# EAGLE design EVGP Daugherboard (EAGLE 9.5.0)
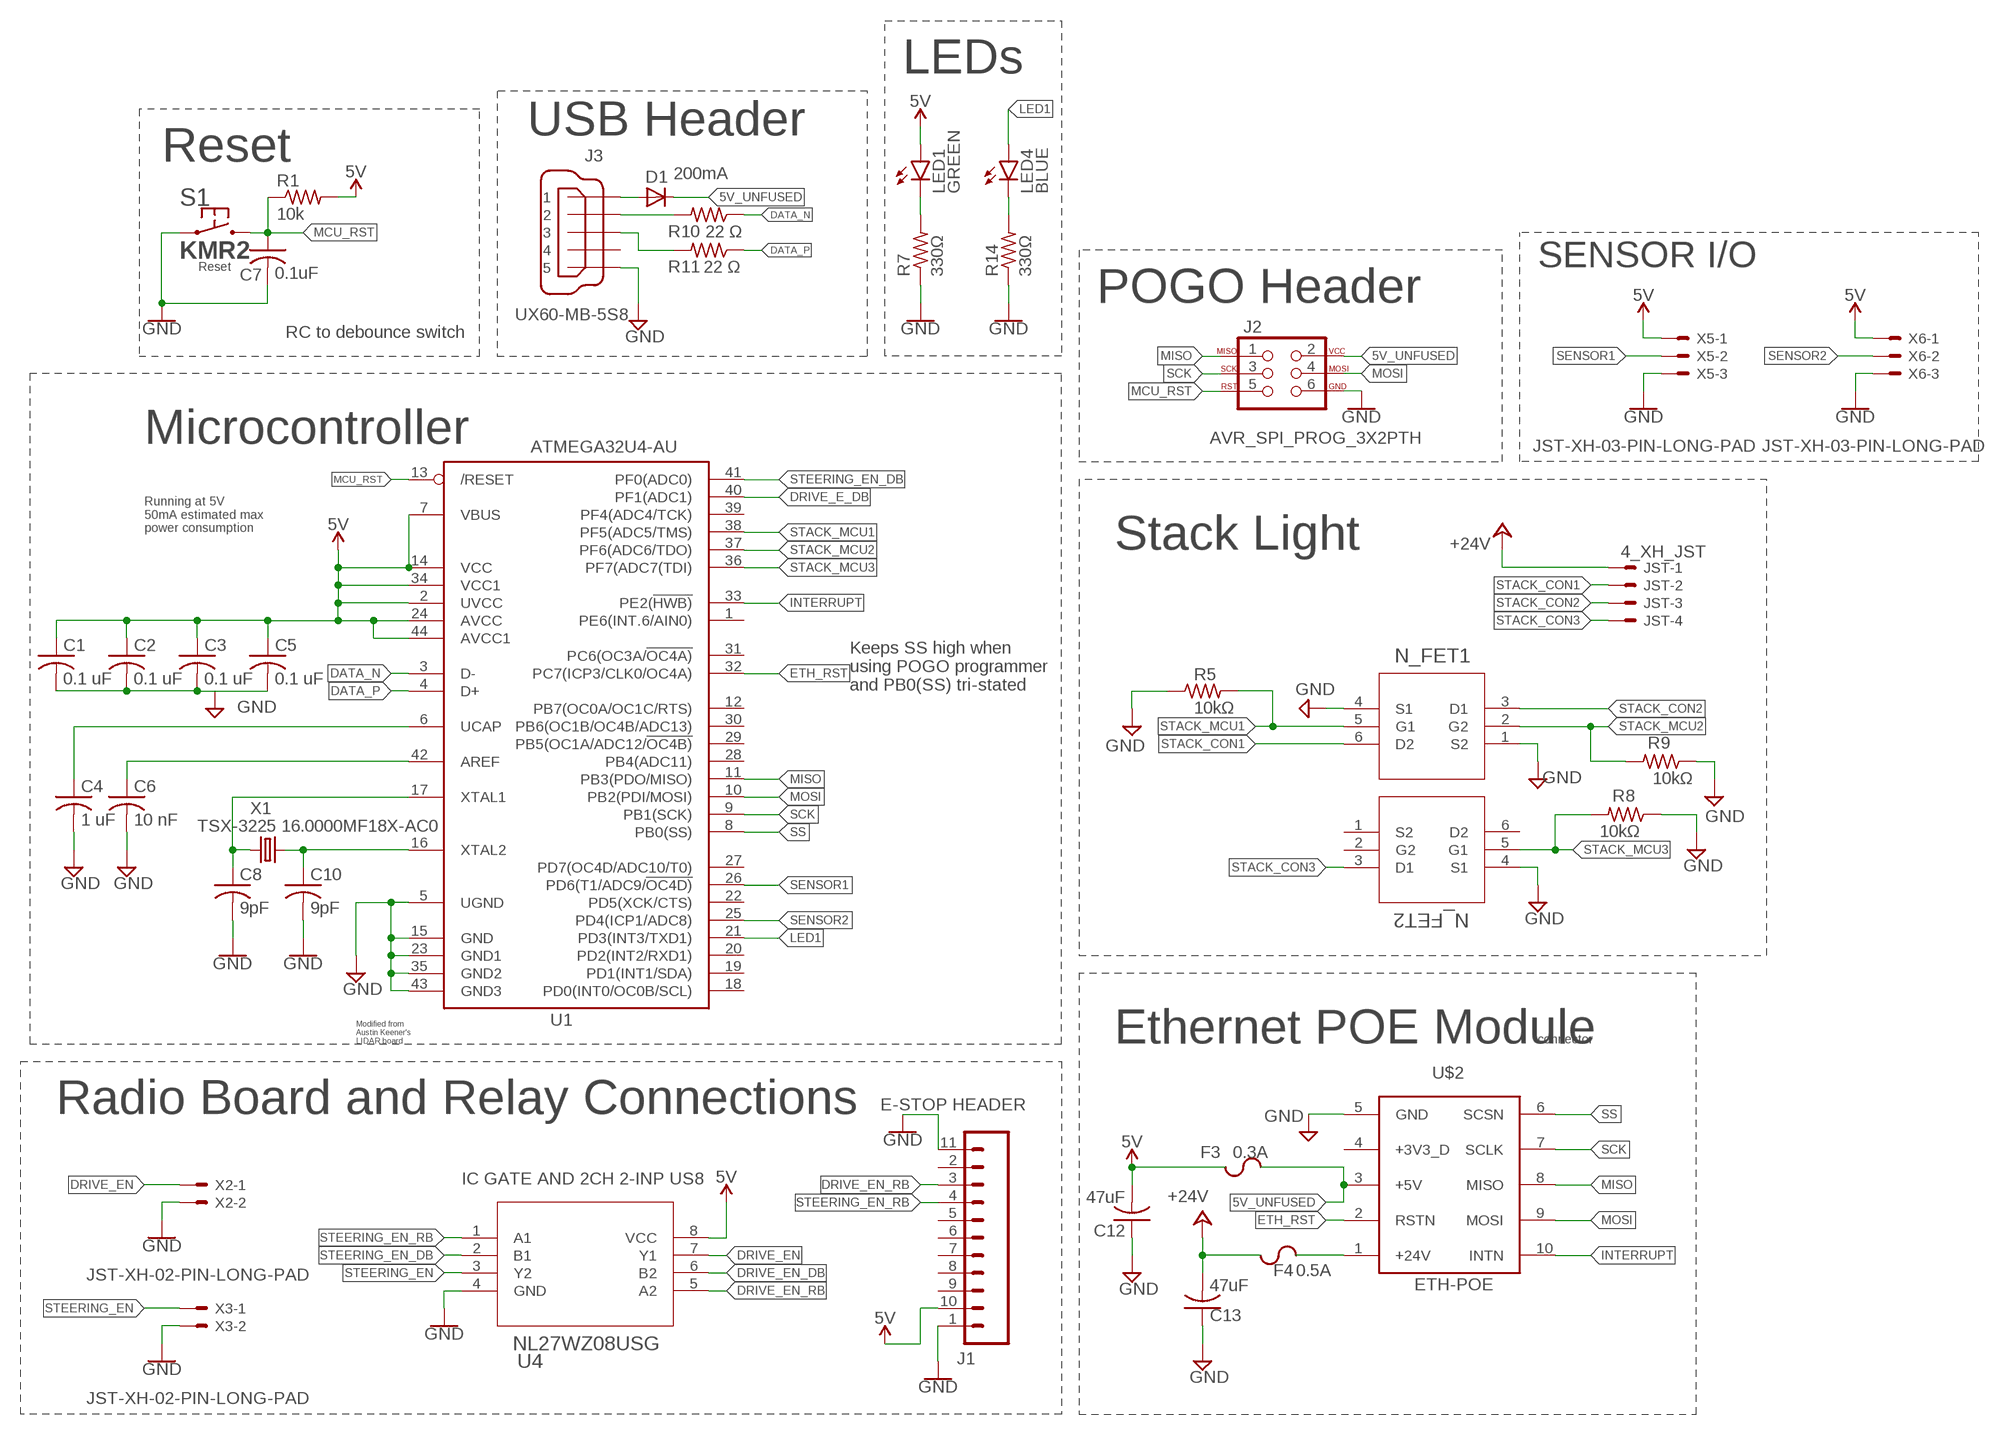
[diagram p0: schematic, sheet 1]

## Parts
C1  0.1 uF  C-USC0603  [C0603]
C2  0.1 uF  C-USC0603  [C0603]
C3  0.1 uF  C-USC0603  [C0603]
C4  1 uF  C-USC0603  [C0603]
C5  0.1 uF  C-USC0603  [C0603]
C6  10 nF  C-USC0603  [C0603]
C7  0.1uF  C-USC0603  [C0603]
C8  9pF  C-USC0603  [C0603]
C10  9pF  C-USC0603  [C0603]
C12  47uF  C-USC1206  [C1206]
C13  47uF  C-USC1206  [C1206]
D1  200mA  DIODE-SOD323-R  [SOD323-R]
F3  0.3A  CHIP_FUSE1206  [F1206]
F4  0.5A  CHIP_FUSE1206  [F1206]
J1  E-STOP HEADER  ESTOP_RADIO  [RADIO_V1.3]
J2  AVR_SPI_PROG_3X2PTH  [2X3]
J3  UX60-MB-5S8  [UX60-MB-5S8]
JST  4_XH_JST  JST-XH-04-PIN-LONG-PAD  [JST-XH-04-PACKAGE-LONG-PAD]
LED1  GREEN  LEDCHIP-LED0603  [CHIP-LED0603]
LED4  BLUE  LEDCHIP-LED0603  [CHIP-LED0603]
R1  10k  R-US_R0603  [R0603]
R5  10kΩ  R-US_R0603  [R0603]
R7  330Ω  R-US_R0603  [R0603]
R8  10kΩ  R-US_R0603  [R0603]
R9  10kΩ  R-US_R0603  [R0603]
R10  22 Ω  R-US_R0603  [R0603]
R11  22 Ω  R-US_R0603  [R0603]
R14  330Ω  R-US_R0603  [R0603]
S1  KMR2  [KMR2]
U1  ATMEGA32U4-AU  [TQFP44]
U4  NL27WZ08USG  [US8_2P40X2P10]
U5  N_FET1  BSS84DW-7-F  [SOT-363]
U6  N_FET2  BSS84DW-7-F  [SOT-363]
U$2  ETH-POE  [HDRVR10W64P4000X254_2X5_1016X508X254B]
X1  TSX-3225 16.0000MF18X-AC0  XTAL-3.2X2.5  [XTAL-3.2X2.5]
X2  JST-XH-02-PIN-LONG-PAD  [JST-XH-02-PACKAGE-LONG-PAD]
X3  JST-XH-02-PIN-LONG-PAD  [JST-XH-02-PACKAGE-LONG-PAD]
X5  JST-XH-03-PIN-LONG-PAD  [JST-XH-03-PACKAGE-LONG-PAD]
X6  JST-XH-03-PIN-LONG-PAD  [JST-XH-03-PACKAGE-LONG-PAD]

## Nets
5V [power]: C1.1 C2.1 C3.1 C5.1 C12.2 F3.1 J1.10(5V) LED1.A R1.2 U1.2(UVCC) U1.7(VBUS) U1.14(VCC) U1.24(AVCC) U1.34(VCC1) U1.44(AVCC1) U4.8(VCC) X5.1 X6.1
5V_UNFUSED [power]: D1.C F3.2 J2.2 U$2.3(+5V)
24V_UNFUSED: F4.2 U$2.1(+24V)
+24V: C13.2 F4.1 JST.1
AREF: C6.1 U1.42(AREF)
DATA_N [RF]: R10.1 U1.3(D-)
DATA_P [RF]: R11.1 U1.4(D+)
DRIVE_E_DB: U1.40(PF1(ADC1))
DRIVE_EN: U4.7(Y1) X2.1
DRIVE_EN_DB: U4.6(B2)
DRIVE_EN_RB: J1.3(D1) U4.5(A2)
ETH_RST: U1.32(PC7(ICP3/CLK0/OC4A)) U$2.2(RSTN)
GND [power]: C1.2 C2.2 C3.2 C4.2 C5.2 C6.2 C7.2 C8.2 C10.2 C12.1 C13.1 J1.1(GND) J1.11(GND) J2.6 J3.5 R5.1 R7.1 R8.1 R9.1 R14.1 S1.1.1 S1.1.2 U1.5(UGND) U1.15(GND) U1.23(GND1) U1.35(GND2) U1.43(GND3) U4.4(GND) U5.1(S2) U5.4(S1) U6.4(S1) U$2.5(GND) X2.2 X3.2 X5.3 X6.3
INTERRUPT: U1.33(PE2(!HWB)) U$2.10(INTN)
LED1: LED4.A U1.21(PD3(INT3/TXD1))
MCU_RST: C7.1 J2.5 R1.1 S1.2.1 S1.2.2 U1.13(/RESET)
MISO: J2.1 U1.11(PB3(PDO/MISO)) U$2.8(MISO)
MOSI: J2.4 U1.10(PB2(PDI/MOSI)) U$2.9(MOSI)
N$3: LED1.C R7.2
N$5: J3.2 R10.2
N$6: LED4.C R14.2
N$7: D1.A J3.1
N$11: J3.3 R11.2
SCK: J2.3 U1.9(PB1(SCK)) U$2.7(SCLK)
SENSOR1: U1.26(PD6(T1/ADC9/!OC4D)) X5.2
SENSOR2: U1.25(PD4(ICP1/ADC8)) X6.2
SS: U1.8(PB0(SS)) U$2.6(SCSN)
STACK_CON1: JST.2 U5.6(D2)
STACK_CON2: JST.3 U5.3(D1)
STACK_CON3: JST.4 U6.3(D1)
STACK_MCU1: R5.2 U1.38(PF5(ADC5/TMS)) U5.5(G1)
STACK_MCU2: R9.2 U1.37(PF6(ADC6/TDO)) U5.2(G2)
STACK_MCU3: R8.2 U1.36(PF7(ADC7(TDI)) U6.5(G1)
STEERING_EN: U4.3(Y2) X3.1
STEERING_EN_DB: U1.41(PF0(ADC0)) U4.2(B1)
STEERING_EN_RB: J1.4(D2) U4.1(A1)
UCAP: C4.1 U1.6(UCAP)
XTAL1: C8.1 U1.17(XTAL1) X1.1
XTAL2: C10.1 U1.16(XTAL2) X1.3
Unconnected: J1.2(RST) J1.5(D3) J1.6(D4) J1.7(D5) J1.8(D6) J1.9(D7) J3.4 U1.1(PE6(INT.6/AIN0)) U1.12(PB7(OC0A/OC1C/RTS)) U1.18(PD0(INT0/OC0B/SCL)) U1.19(PD1(INT1/SDA)) U1.20(PD2(INT2/RXD1)) U1.22(PD5(XCK/CTS)) U1.27(PD7(OC4D/ADC10/T0)) U1.28(PB4(ADC11)) U1.29(PB5(OC1A/ADC12/!OC4B)) U1.30(PB6(OC1B/OC4B/ADC13)) U1.31(PC6(OC3A/!OC4A)) U1.39(PF4(ADC4/TCK)) U6.1(S2) U6.2(G2) U6.6(D2) U$2.4(+3V3_D)

## Notes on the sheet
- LEDs
- USB Header
- Reset
- SENSOR I/O
- POGO Header
- RC to debounce switch
- Microcontroller
- Running at 5V
  50mA estimated max
  power consumption
- Stack Light
- Keeps SS high when
  using POGO programmer
  and PB0(SS) tri-stated
- Modified from 
  Austin Keener's 
  LIDAR board
- Ethernet POE Module | connector
- Radio Board and Relay Connections
- IC GATE AND 2CH 2-INP US8

## Library data of the parts
C1-C6 C8 C10 = resistor:C-US: CAPACITOR, American symbol
C7 C12 C13 = rcl:C-US: CAPACITOR, American symbol; SPICEPREFIX: C
D1 = RoboJackets-Diodes:DIODE-: DIODE
F3 F4 = RoboJackets-Fuses:CHIP_FUSE
J1 = board_outline:ESTOP_RADIO
J2 = SparkFun-Connectors:AVR_SPI_PROG_3X2: AVR ISP 6 Pin This is the reduced ISP connector for AVR programming. Common on Arduino. This footprint will take up less PCB space and can be used with a 10-pin to 6-pin adapter such as SKU: BOB-08508 **Special note about "TEST_POINT" package. The stop mask is on the top side, so if you want your programming test points to be on the bottom of your board, make sure to place this package on the bottom side of the board. This also ensure that the orientation to program from the bottom side will be correct. SparkFun Products: SparkFun ISP Pogo Adapter <https://www.sparkfun.com/products/11591> - NS Tiny AVR Programmer <https://www.sparkfun.com/products/11801> -PTH
J3 = RoboJackets-Connectors:UX60*-MB-5S?: Mini USB Connector Brand: Hirose Electric Co Ltd <http://www.hirose.com/us/> Series: UX <http://www.digikey.com/product-search/en?FV=fff40016,fff802e4,ffec3225> Distributor: Digi-Key <http://www.digikey.com/product-detail/en/UX60A-MB-5ST/H2961CT-ND/597540>; PINS: 5
JST = Rembrandt Electronics - JST XH Connectors v1-0:JST-XH-04-PIN: JST XH Connector 2 Pin Wire to board connector. Pitch: 2,54 mm, (0.100") Number of pins: 4 Created by Rembrandt Electronics www.rembrandtelectronics.com
LED1 LED4 = led:LED: LED OSRAM: - CHIPLED LG R971, LG N971, LY N971, LG Q971, LY Q971, LO R971, LY R971 LH N974, LH R974 LS Q976, LO Q976, LY Q976 LO Q996 - Hyper CHIPLED LW Q18S LB Q993, LB Q99A, LB R99A - SideLED LS A670, LO A670, LY A670, LG A670, LP A670 LB A673, LV A673, LT A673, LW A673 LH A674 LY A675 LS A676, LA A676, LO A676, LY A676, LW A676 LS A679, LY A679, LG A679 - Hyper Micro SIDELED® LS Y876, LA Y876, LO Y876, LY Y876 LT Y87S - SmartLED LW L88C, LW L88S LB L89C, LB L89S, LG L890 LS L89K, LO L89K, LY L89K LS L896, LA L896, LO L896, LY L896 - TOPLED LS T670, LO T670, LY T670, LG T670, LP T670 LSG T670, LSP T670, LSY T670, LOP T670, LYG T670 LG T671, LOG T671, LSG T671 LB T673, LV T673, LT T673, LW T673 LH T674 LS T676, LA T676, LO T676, LY T676, LB T676, LH T676, LSB T676, LW T676 LB T67C, LV T67C, LT T67C, LS T67K, LO T67K, LY T67K, LW E67C LS E67B, LA E67B, LO E67B, LY E67B, LB E67C, LV E67C, LT E67C LW T67C LS T679, LY T679, LG T679 LS T770, LO T770, LY T770, LG T770, LP T770 LB T773, LV T773, LT T773, LW T773 LH T774 LS E675, LA E675, LY E675, LS T675 LS T776, LA T776, LO T776, LY T776, LB T776 LHGB T686 LT T68C, LB T68C - Hyper Mini TOPLED® LB M676 - Mini TOPLED Santana® LG M470 LS M47K, LO M47K, LY M47K Source: http://www.osram.convergy.de LUXEON: - LUMILED® LXK2-PW12-R00, LXK2-PW12-S00, LXK2-PW14-U00, LXK2-PW14-V00 LXK2-PM12-R00, LXK2-PM12-S00, LXK2-PM14-U00 LXK2-PE12-Q00, LXK2-PE12-R00, LXK2-PE12-S00, LXK2-PE14-T00, LXK2-PE14-U00 LXK2-PB12-K00, LXK2-PB12-L00, LXK2-PB12-M00, LXK2-PB14-N00, LXK2-PB14-P00, LXK2-PB14-Q00 LXK2-PR12-L00, LXK2-PR12-M00, LXK2-PR14-Q00, LXK2-PR14-R00 LXK2-PD12-Q00, LXK2-PD12-R00, LXK2-PD12-S00 LXK2-PH12-R00, LXK2-PH12-S00 LXK2-PL12-P00, LXK2-PL12-Q00, LXK2-PL12-R00 Source: www.luxeon.com KINGBRIGHT: KA-3528ASYC Source: www.kingbright.com
R1 R5 R7-R11 R14 = rcl:R-US_: RESISTOR, American symbol; SPICEPREFIX: R
S1 = RoboJackets-Switches:KMR2; FUNCTION: Reset
U1 = estop-v1.0:ATMEGA32U4: http://www.ladyada.net/library/eagle
U4 = DownloadedFiles:NL27WZ08USG; MANUFACTURER_PART_NUMBER: NL27WZ08USG; VENDOR: ON Semiconductor
U5 U6 = DownloadedParts:BSS84DW-7-F: dual mosfet; MANUFACTURER_PART_NUMBER: BSS84DW7F; VENDOR: Diodes Inc
U$2 = ethernet_poe:ETH-POE: POE
X1 = RoboJackets-FreqGen:XTAL
X2 X3 = Rembrandt Electronics - JST XH Connectors v1-0:JST-XH-02-PIN: JST XH Connector 2 Pin Wire to board connector. Pitch: 2,54 mm, (0.100") Number of pins: 2 Created by Rembrandt Electronics www.rembrandtelectronics.com
X5 X6 = Rembrandt Electronics - JST XH Connectors v1-0:JST-XH-03-PIN: JST XH Connector 2 Pin Wire to board connector. Pitch: 2,54 mm, (0.100") Number of pins: 3 Created by Rembrandt Electronics www.rembrandtelectronics.com

## Net classes
0 default: width 0.203 mm, drill 0.508 mm, clearance 0.178 mm
1 power: width 0.305 mm, drill 0.508 mm, clearance 0.178 mm
2 RF: width 0.203 mm, clearance 0.178 mm

## Board
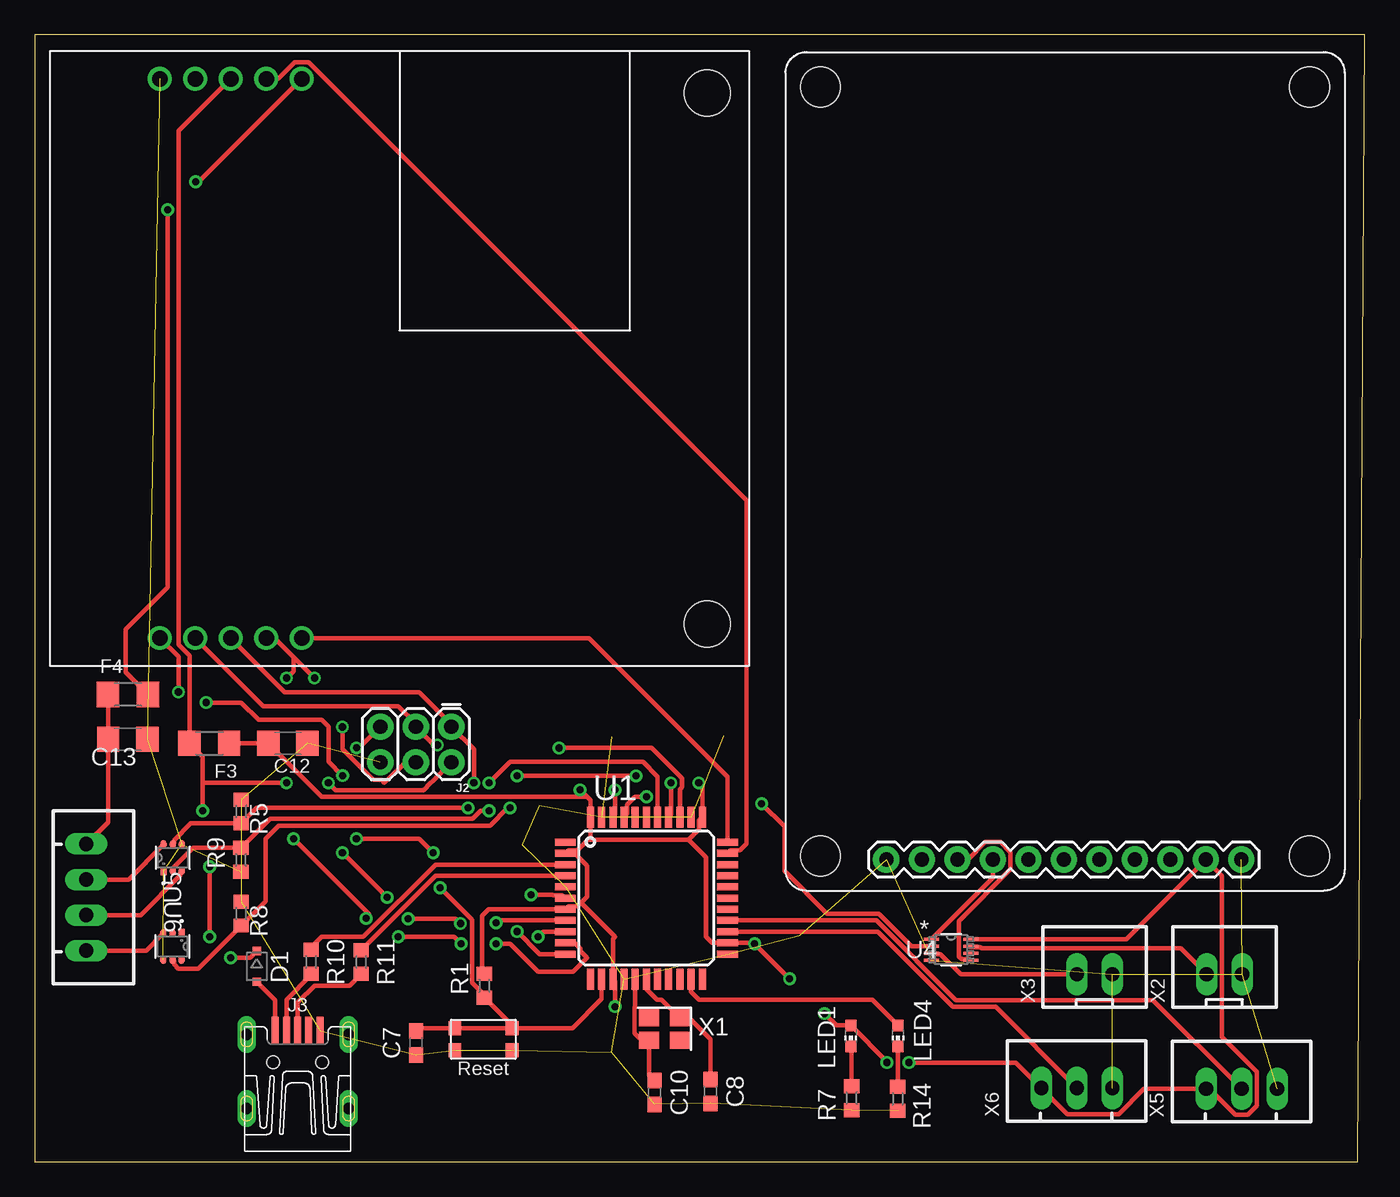
[diagram p1: board, top side]
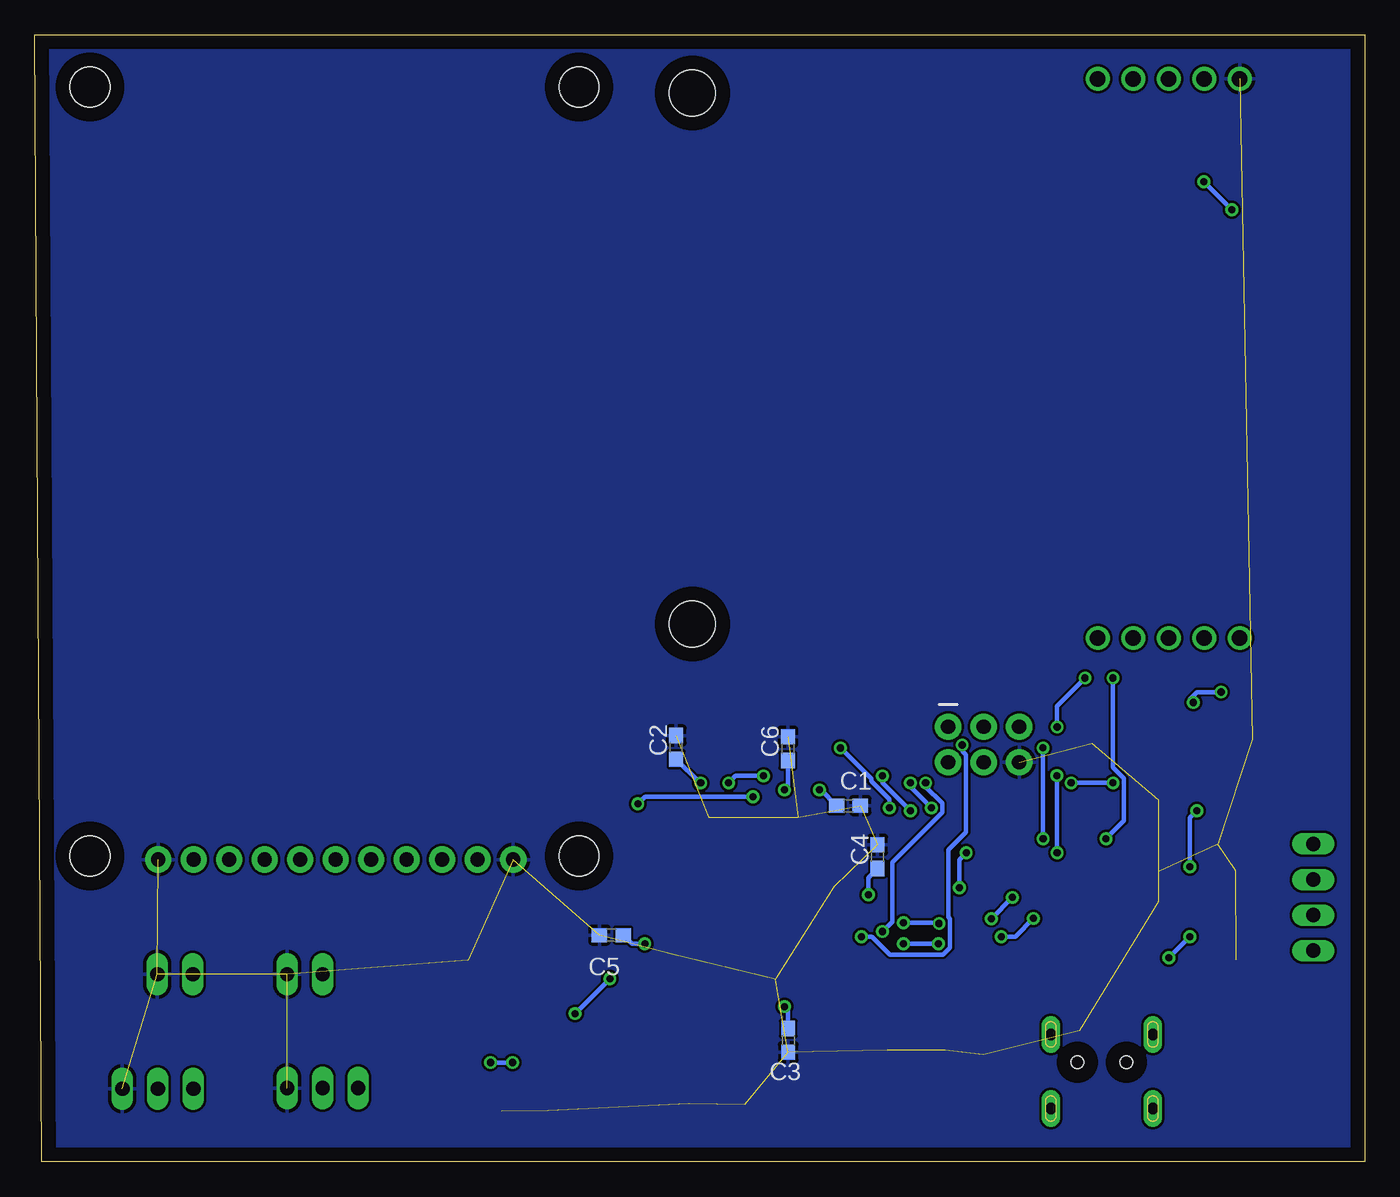
[diagram p2: board, bottom side, seen from below]

Size 95.14 x 80.59 mm. Coordinates in mm from the lower left corner, seen from the top.
Outline: 0,0 94.64,0 95.14,80.59 0,80.59 0,0
Copper layers (1*16): Top 0.035mm / dielectric 1.5mm / Bottom 0.035mm
Design rules "default": minimum track width 6mil, minimum drill 0.35mm, track to track 6mil, track to pad 6mil, pad to pad 6mil, via to via 6mil, smd to smd 6mil, copper to edge 40mil, drill to drill 6mil, minimum pad ring 10mil, minimum via ring 8mil, stop-mask expansion 4mil, vias tented up to drill 0mil, thermal gap 10mil

### Footprints (pad centres in the part's own frame; a part is rotated, then mirrored left to right if it is on the bottom)
C0603 = smd 1.1 x 1: 1 -0.85,0; 2 0.85,0
C1206 = smd 1.6 x 1.8: 1 -1.4,0; 2 1.4,0
SOD323-R = smd 0.6 x 0.6: A 1.1,0; C -1.1,0
F1206 = smd 1.6 x 1.803: 1 -1.422,0; 2 1.422,0
RADIO_V1.3 = drill 1.016 pad 1.88: 1 57.76,7.21; 2 57.76,9.75; 3 57.76,12.29; 4 57.76,14.83; 5 57.76,17.37; 6 57.76,19.91; 7 57.76,22.45; 8 57.76,24.99; 9 57.76,27.53; 10 57.76,30.07; 11 57.76,32.61 | hole 2.85: 2.5,2.5; 57.5,2.5; 2.5,37.5; 57.5,37.5
2X3 = drill 1.016 pad 1.88: 1 0,0; 2 0,2.54; 3 2.54,0; 4 2.54,2.54; 5 5.08,0; 6 5.08,2.54
UX60-MB-5S8 = smd 2 x 0.5: 1 8.65,1.6; 2 8.65,0.8; 3 8.65,0; 4 8.65,-0.8; 5 8.65,-1.6 | drill 0.8 long: M1 3.1,-3.65; M2 3.1,3.65; M3 8.4,3.65; M4 8.4,-3.65 | hole 0.9: 6.4,-1.75; 6.4,1.75
JST-XH-04-PACKAGE-LONG-PAD = drill 1.016 long: 1 -3.81,0; 2 -1.27,0; 3 1.27,0; 4 3.81,0
CHIP-LED0603 = smd 0.8 x 0.8: A 0,-0.75; C 0,0.75
R0603 = smd 1 x 1.1: 1 -0.85,0; 2 0.85,0
KMR2 = smd 0.9 x 1: 1.1 -2.05,0.8; 1.2 2.05,0.8; 2.1 -2.05,-0.8; 2.2 2.05,-0.8
TQFP44 = smd 1.5 x 0.5: 1 -5.8,4; 2 -5.8,3.2; 3 -5.8,2.4; 4 -5.8,1.6; 5 -5.8,0.8; 6 -5.8,0; 7 -5.8,-0.8; 8 -5.8,-1.6; 9 -5.8,-2.4; 10 -5.8,-3.2; 11 -5.8,-4; 23 5.8,-4; 24 5.8,-3.2; 25 5.8,-2.4; 26 5.8,-1.6; 27 5.8,-0.8; 28 5.8,0; 29 5.8,0.8; 30 5.8,1.6; 31 5.8,2.4; 32 5.8,3.2; 33 5.8,4 | smd 0.5 x 1.5: 12 -4,-5.8; 13 -3.2,-5.8; 14 -2.4,-5.8; 15 -1.6,-5.8; 16 -0.8,-5.8; 17 0,-5.8; 18 0.8,-5.8; 19 1.6,-5.8; 20 2.4,-5.8; 21 3.2,-5.8; 22 4,-5.8; 34 4,5.8; 35 3.2,5.8; 36 2.4,5.8; 37 1.6,5.8; 38 0.8,5.8; 39 0,5.8; 40 -0.8,5.8; 41 -1.6,5.8; 42 -2.4,5.8; 43 -3.2,5.8; 44 -4,5.8
US8_2P40X2P10 = smd 1.067 x 0.203: 1 -1.422,0.75; 2 -1.422,0.25; 3 -1.422,-0.25; 4 -1.422,-0.75; 5 1.422,-0.75; 6 1.422,-0.25; 7 1.422,0.25; 8 1.422,0.75
SOT-363 = smd 0.6 x 0.42: 1 -0.95,0.65; 2 -0.95,0; 3 -0.95,-0.65; 4 0.95,-0.65; 5 0.95,0; 6 0.95,0.65
HDRVR10W64P4000X254_2X5_1016X508X254B = drill 1.105 pad 1.705: 1 2,18; 2 2,15.46; 3 2,12.92; 4 2,10.38; 5 2,7.84; 6 42,7.84; 7 42,10.38; 8 42,12.92; 9 42,15.46; 10 42,18 | hole 3.3: 3,47; 41,47
XTAL-3.2X2.5 = smd 1.4 x 1.2: 1 -1.1,-0.8; 2 1.1,-0.8; 3 1.1,0.8; 4 -1.1,0.8
JST-XH-02-PACKAGE-LONG-PAD = drill 1.016 long: 1 -1.27,0; 2 1.27,0
JST-XH-03-PACKAGE-LONG-PAD = drill 1.016 long: 1 -2.54,0; 2 0,0; 3 2.54,0

### Placement (x,y rotation side)
C1  36.93,25.46 0 bottom
C2  49.26,29.63 90 bottom
C3  41.24,8.67 270 bottom
C4  34.84,21.82 90 bottom
C5  53.9,16.21 180 bottom
C6  41.26,29.54 90 bottom
C7  27.26,8.49 270 top
C8  48.34,5.02 270 top
C10  44.34,4.94 270 top
C12  18.1,29.92 180 top
C13  6.64,30.22 180 top
D1  15.87,13.97 270 top
F3  12.48,29.92 180 top
F4  6.66,33.42 0 top
J1  53.71,79.37 270 top
J2  29.79,31.11 180 top
J3  18.8,0.7 90 top
JST  3.67,18.91 270 top
LED1  58.38,8.99 180 top
LED4  61.76,8.99 180 top
R1  32.16,12.58 90 top
R5  14.76,25.04 270 top
R7  58.44,4.54 90 top
R8  14.76,17.74 270 top
R9  14.74,21.59 90 top
R10  19.76,14.29 270 top
R11  23.34,14.28 270 top
R14  61.74,4.49 90 top
S1  32.09,8.75 180 top
U1  43.75,18.85 0 top
U4  65.56,15.16 0 top
U5  9.86,21.74 90 top
U6  9.84,15.39 270 top
U$2  1.09,79.45 270 top
X1  45.04,9.49 180 top
X2  85.11,13.4 0 top
X3  75.82,13.4 0 top
X5  86.34,5.21 0 top
X6  74.55,5.26 0 top

### Tracks (layer width: path | path; a pad name or v marks a point on that pad's centre or on a via)
5V  (via drill 0.51)
  Top 0.305: v41.5,11.09 41.5,12.9 U1.14 41.35,15.94 41.5,16.09 39.08,18.51 | U4.8 78.08,15.91 J1.10 84.93,20.46 84.93,8.92 87.43,6.42 87.43,4 86.79,3.36 85.89,3.36 84.03,5.21 X5.1 79.35,5.21 77.54,3.41 73.86,3.41 X6.1 70.18,7.09 v62.55,7.09 | v54,13.09 v51.5,15.59 51.44,15.65 U1.24 48.44,15.65 48,16.09 48,21.79 46.78,23.01 | v56.5,10.59 57.35,9.74 LED1.A 60.97,7.15 v60.97,7.09 | v47.5,27.09 47.75,26.84 U1.34 47.53,24.43 47.53,23.76 46.78,23.01 | v39,26.59 39.5,26.09 | 39.5,26.09 39.75,25.84 U1.44 39.75,23.18 39.58,23.01 | F3.1 C12.2 20.53,26.09 39.5,26.09 | 39.08,18.51 38.84,18.27 38.17,18.27 U1.7 37,18.05 36.78,18.05 32.46,18.05 32,17.59 32,13.59 R1.2 | 39.08,18.51 39.5,18.93 39.5,21.17 38.62,22.05 U1.2 38.17,22.27 38.84,22.27 39.58,23.01 | 39.58,23.01 46.78,23.01
  Bottom 0.305: C3.1 41.24,11.09 v41.5,11.09 | v51.5,15.59 52.43,15.59 C5.1 | v54,13.09 v56.5,10.59 | v60.97,7.09 v62.55,7.09 | C2.1 47.57,27.09 v47.5,27.09 | C1.1 38.91,26.59 v39,26.59
5V_UNFUSED  (via drill 0.51)
  Top 0.305: U$2.3 10.29,73.73 10.29,36.96 11.06,36.19 F3.2 12,28.98 12,27.09 | v12.5,21.09 v12.5,16.09 | v14,14.59 15.39,14.59 D1.C | J2.2 28.41,27.18 28.31,27.09 27.79,26.57 21.5,26.57 21,27.07 v21,27.09 | v12,25.09 12,27.09 | 12,27.09 v18,27.09
  Bottom 0.305: v12,25.09 12.5,24.59 v12.5,21.09 | v12.5,16.09 v14,14.59 | v18,27.09 v21,27.09
24V_UNFUSED  (via drill 0.51)
  Top 0.305: U$2.1 11.73,70.09 v11.5,70.09 | v9.5,68.09 9.5,41.09 6.5,38.09 6.5,35 F4.2
  Bottom 0.305: v11.5,70.09 v9.5,68.09 | v9.5,68.09
+24V
  Top 0.305: C13.2 5.24,30.09 | 5.24,30.09 5.24,24.29 JST.1 | F4.1 5.24,30.09
AREF  (via drill 0.51)
  Top 0.305: v41.5,26.59 41.5,24.8 U1.42
  Bottom 0.305: C6.1 41.26,26.83 v41.5,26.59
DATA_N
  Top 0.305: U1.3 28.66,21.25 23.5,16.09 20.5,16.09 19.76,15.35 R10.1
DATA_P
  Top 0.305: R11.1 28.66,20.45 U1.4
DRIVE_EN
  Top 0.305: X2.1 81.99,15.25 67.74,15.25 67.65,15.34 66.91,15.34 U4.7
DRIVE_EN_RB
  Top 0.305: J1.3 66.74,21.61 68.01,22.88 69.07,22.88 69.81,22.14 69.81,20.9 66.12,17.21 66.12,14.67 66.31,14.48 66.91,14.48 U4.5
ETH_RST
  Top 0.305: U1.32 49.77,22.27 50.44,22.27 50.91,22.74 50.91,47.3 19.58,78.63 18.6,78.63 17.42,77.45 U$2.2
GND  (35 unrouted)
  pour Bottom: -0.81,81.23 95.78,81.23 95.78,-1.08 -0.81,-1.08
INTERRUPT
  Top 0.305: U1.33 49.55,27.54 39.64,37.45 U$2.10
LED1
  Top 0.305: LED4.A 59.91,11.59 47.5,11.59 46.95,12.14 U1.21
MCU_RST  (via drill 0.51)
  Top 0.305: S1.2.1 38.46,9.55 40.55,11.64 U1.13 | S1.2.1 34.14,9.75 R1.1 32.16,11.91 31.28,12.79 31.28,17.31 v29,19.59 | S1.2.1 S1.2.2 27.47,9.55 C7.1 | 24.52,31.11 J2.5 23.19,29.59 v23,29.59 | v23,23.09 27.5,23.09 v28.5,22.09
  Bottom 0.305: v23,29.59 v23,23.09 | v28.5,22.09 29,21.59 v29,19.59
MISO  (via drill 0.51)
  Top 0.305: U$2.8 17.87,33.59 27.5,33.59 29.79,31.3 J2.1 31.41,29.49 v31.41,27.09 | U1.11 36.11,14.85 v34.5,16.46
  Bottom 0.305: v34.5,16.46 33.79,17.18 33.79,21.4 30.21,24.98 30.21,25.63 31.41,26.82 v31.41,27.09
MOSI  (via drill 0.51)
  Top 0.305: U$2.9 17.14,37.45 18.5,36.09 | 18.5,36.09 v20,34.59 | J2.4 26.51,28.57 25.24,27.3 25.21,27.3 25,27.09 24.79,27.3 24.18,27.3 22,29.48 v22,31.09 | 18.5,36.09 18.5,35.09 v18,34.59 | v18.5,23.09 23.91,17.68 23.91,17.18 v23.69,17.4 | v26,16.09 29.99,16.09 v30.49,15.59 | v33,15.59 34,15.59 36,13.59 38.5,13.59 39.5,14.59 39.03,15.06 39.03,15.24 38.62,15.65 U1.10
  Bottom 0.305: v20,34.59 22,32.59 v22,31.09 | v18,34.59 18,28.2 17.21,27.42 17.21,24.38 v18.5,23.09 | v23.69,17.4 25,16.09 v26,16.09 | v30.49,15.59 v33,15.59
N$3
  Top 0.305: LED1.C 58.44,8.18 R7.2
N$5
  Top 0.305: R10.2 19.76,13.35 18,11.59 J3.2
N$6
  Top 0.305: LED4.C 61.76,5.36 R14.2
N$7
  Top 0.305: D1.A 17.2,11.54 J3.1
N$11
  Top 0.305: R11.2 22.5,12.59 20,12.59 18.8,11.39 J3.3
SCK  (via drill 0.51)
  Top 0.305: U$2.7 16.33,32.59 26,32.59 27.25,31.34 J2.3 28.56,29.8 v28.79,29.8 | v36,16.09 36.36,16.45 U1.9
  Bottom 0.305: v28.79,29.8 28.79,29.37 28.52,29.1 28.52,23.57 29.79,22.3 29.79,17.49 29.66,17.36 29.66,15.31 30.17,14.8 33.95,14.8 35.24,16.09 v36,16.09
SENSOR1
  Top 0.305: X5.2 80,11.55 65.9,11.55 60.2,17.25 U1.26
SENSOR2
  Top 0.305: U1.25 60.31,16.45 65.7,11.06 68.75,11.06 X6.2
SS  (via drill 0.51)
  Top 0.305: U$2.6 10.27,36.11 v10.27,33.59 | v12.25,32.84 14.75,32.84 16,31.59 20.5,31.59 21,31.09 21,28.59 21.98,27.61 v22.02,27.61 | v22,22.09 v25.19,18.9 | v26.71,17.38 30.09,17.38 v30.44,17.03 | v33,17.09 33.16,17.25 U1.8
  Bottom 0.305: v10.27,33.59 12,33.59 12.5,33.09 v12.25,32.84 | v22.02,27.61 22.02,22.11 v22,22.09 | v25.19,18.9 v26.71,17.38 | v30.44,17.03 30.5,17.09 v33,17.09
STACK_CON1
  Top 0.305: U5.6 6.7,20.18 JST.2
STACK_CON2
  Top 0.305: U5.3 10.4,20.68 10.4,20.48 7.56,17.64 JST.3
STACK_CON3
  Top 0.305: U6.3 7.95,15.1 JST.4
STACK_MCU1  (via drill 0.51)
  Top 0.305: U5.5 9.97,22.8 9.97,23 11.16,24.19 R5.2 15.87,25.3 v31,25.3 | v32.5,27.09 34,28.59 43.5,28.59 44.55,27.54 U1.38
  Bottom 0.305: v31,25.3 32.5,26.8 v32.5,27.09
STACK_MCU2  (via drill 0.51)
  Top 0.305: U5.2 9.92,20.85 9.92,21.05 11.31,22.44 R9.2 16.82,24.51 31.33,24.51 31.9,25.09 v32.5,25.09 | v34.5,27.59 v43,27.59 | v45.5,27.09 45.5,24.8 U1.37
  Bottom 0.305: v32.5,25.09 34.5,27.09 v34.5,27.59 | v43,27.59 45,27.59 v45.5,27.09
STACK_MCU3  (via drill 0.51)
  Top 0.305: U6.5 9.95,14.33 9.95,14.13 10.27,13.81 11.68,13.81 R8.2 16.5,18.63 16.5,23.09 17.44,24.03 32.56,24.03 33.83,25.3 v34,25.3 | U1.36 46.15,26.63 46.29,26.76 46.29,27.42 44.11,29.59 v37.5,29.59
  Bottom 0.305: v34,25.3 34,25.91 35.29,27.19 35.29,27.38 v37.5,29.59
STEERING_EN
  Top 0.305: U4.3 64.21,14.84 64.81,14.84 66.25,13.4 X3.1
STEERING_EN_DB  (via drill 0.51)
  Top 0.305: U1.41 42.37,24.87 42.37,25.54 42.92,26.09 v43.76,26.09 | U4.2 62.72,15.41 60.4,17.73 56.68,17.73 53.62,20.8 53.62,23.97 v52,25.59
  Bottom 0.305: v43.76,26.09 51.5,26.09 v52,25.59
STEERING_EN_RB
  Top 0.305: J1.4 68.54,20.31 U4.1
UCAP  (via drill 0.51)
  Top 0.305: v35.5,19.09 37.04,19.09 37.06,19.07 37.73,19.07 U1.6
  Bottom 0.305: C4.1 35.5,20.31 v35.5,19.09
XTAL1
  Top 0.305: U1.17 43.75,12.34 44.5,11.59 44.84,11.59 X1.1 46.8,10.29 48.34,8.75 C8.1
XTAL2
  Top 0.305: U1.16 42.95,11.07 42.91,11.03 42.91,9.18 43.4,8.69 X1.3 43.94,6.19 C10.1